# EAGLE design pwrfet (EAGLE 4.13)

## Sheet 1 of 2
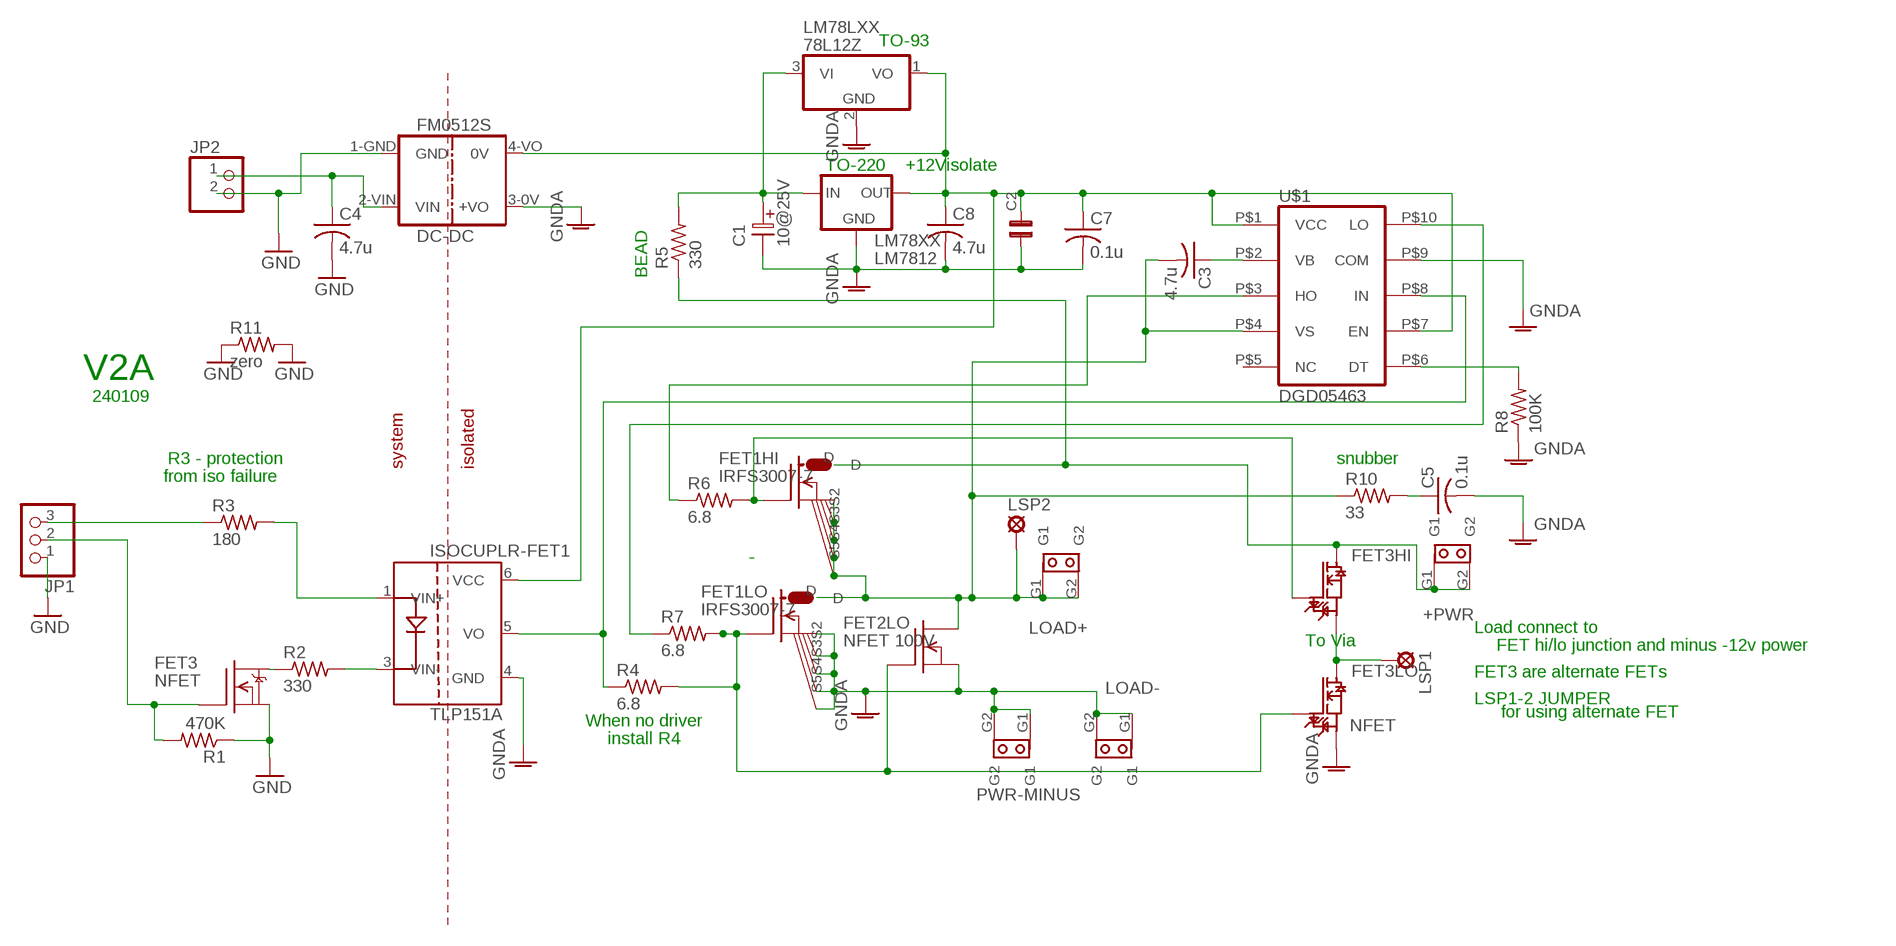
[diagram p0: schematic, sheet 1]

### Parts
+PWR  SPADE-TAB  [SPADE_TAB]
C1  10@25V  ELC-2,5L  [ES-2,5L]
C2  C1210  [1210]
C3  4.7u  C-USC0805  [C0805]
C4  4.7u  C-USC0805  [C0805]
C5  0.1u  C-USC0603  [C0603]
C7  0.1u  C-USC0603  [C0603]
C8  4.7u  C-USC0805  [C0805]
FET1HI  IRFS3007-7  [D2PAK-7]
FET1LO  IRFS3007-7  [D2PAK-7]
FET2LO  NFET 100V  RFP30N06  [TO220V]
FET3  NFET  DMN3404L  [SOT-23]
FET3HI  NFET-DT  [D-PAK-4]
FET3LO  NFET  NFET-DT  [D-PAK-4]
FM0512S  DC-DC  [DC-DC]
ISOCUPLR-FET1  TLP151A  [SOT23-5X]
JP1  PINHD-1X3  [1X03]
JP2  PINHD-1X2  [1X02]
LM78LXX  78L12Z  [TO92]
LM78XX  LM7812  78XXS  [78XXS]
LOAD+  SPADE-TAB  [SPADE_TAB]
LOAD-  SPADE-TAB  [SPADE_TAB]
LSP1  LoadB  LSP10  [LSP10]
LSP2  LoadB  LSP10  [LSP10]
PWR-MINUS  SPADE-TAB  [SPADE_TAB]
R1  470K  R-US_R0603  [R0603]
R2  330  R-US_R0603  [R0603]
R3  180  R-US_R0603  [R0603]
R4  6.8  R-US_R0603  [R0603]
R5  330  R-US_R0603  [R0603]
R6  6.8  R-US_R0603  [R0603]
R7  6.8  R-US_R0603  [R0603]
R8  100K  R-US_R0603  [R0603]
R10  33  R-US_R0603  [R0603]
R11  zero  R-US_R0603  [R0603]
U$1  DGD05463  [MSOP-10]

### Nets
+5VAUX: C4.1 FM0512S.2-VIN(VIN) JP2.1
+12VISO: C2.2 C7.1 C8.1 FM0512S.4-VO(0V) ISOCUPLR-FET1.6(VCC) LM78LXX.1(VO) LM78XX.OUT U$1.P$1(VCC) U$1.P$7(EN)
+PWR: +PWR.G1 +PWR.G2 FET1HI.D FET3HI.D R5.1
+PWR_RC: C1.1 LM78LXX.3(VI) LM78XX.IN R5.2
DRAINFET1: C3.2 FET1HI.S2(S1) FET1HI.S3(S2) FET1HI.S5(S3) FET1HI.S6(S4) FET1HI.S7(S5) FET1LO.D FET2LO.2(D) LOAD+.G1 LOAD+.G2 LSP2.MP R10.1 U$1.P$4(VS)
DT: R8.2 U$1.P$6(DT)
FET2GATE: FET1HI.G FET3HI.G R6.2
FET3-LOAD: FET3HI.S FET3LO.D LSP1.MP
GATE-FET1: FET1LO.G FET2LO.1(G) FET3LO.G R4.2 R7.2
GND: C4.2 FET3.2(S) FM0512S.1-GND(GND) JP1.1 JP2.2 R1.1 R11.1 R11.2
GNDA: C1.2 C2.1 C5.2 C7.2 C8.2 FET1LO.S2(S1) FET1LO.S3(S2) FET1LO.S5(S3) FET1LO.S6(S4) FET1LO.S7(S5) FET2LO.3(S) FET3LO.S FM0512S.3-0V(+VO) ISOCUPLR-FET1.4(GND) LM78LXX.2(GND) LM78XX.GND LOAD-.G1 LOAD-.G2 PWR-MINUS.G1 PWR-MINUS.G2 R8.1 U$1.P$9(COM)
HO: R6.1 U$1.P$3(HO)
IN: ISOCUPLR-FET1.5(VO) R4.1 U$1.P$8(IN)
ISO-ANODE: ISOCUPLR-FET1.1(VIN+) R3.2
ISO-CATH: ISOCUPLR-FET1.3(VIN-) R2.2
ISO-IN-DRAIN-FET1: FET3.3(D) R2.1
LO: R7.1 U$1.P$10(LO)
N$1: JP1.3 R3.1
ONOFF-FET1: FET3.1(G) JP1.2 R1.2
SNUB-RC: C5.1 R10.2
VB: C3.1 U$1.P$2(VB)
Unconnected: U$1.P$5(NC)

### Notes on the sheet
- TO-93
- TO-220 | +12Visolate
- BEAD
- V2A
- 240109
- R3 - protection | system | isolated | snubber
- from iso failure
- Load connect to
- To Via | FET hi/lo junction and minus -12v power
- FET3 are alternate FETs
- LSP1-2 JUMPER
- for using alternate FET
- When no driver
- install R4

## Sheet 2 of 2

## Library data of the parts
+PWR LOAD+ LOAD- PWR-MINUS = DEH:SPADE-TAB
C1 = DEH:ELC-2,5L
C2 = capsmd:C1210
C3-C5 C7 C8 = rcl:C-US: CAPACITOR, American symbol
FET1HI FET1LO = transistor-fet:IRFS3007-7
FET2LO = transistor-fet:RFP30N06
FET3 = transistor-fet:DMN3404L
FET3HI FET3LO = DEH:NFET-DT
FM0512S = DEH:DC-DC
ISOCUPLR-FET1 = texas:TLP151A
JP1 = pinhead:PINHD-1X3: PIN HEADER
JP2 = pinhead:PINHD-1X2: PIN HEADER
LM78LXX = linear:78*: Positive VOLTAGE REGULATOR
LM78XX = v-reg:78XXS: VOLTAGE REGULATOR
LSP1 LSP2 = solpad:LSP10: SOLDER PAD drill 1.0 mm, distributor Buerklin, 12H555
R1-R8 R10 R11 = rcl:R-US_: RESISTOR, American symbol
U$1 = 74xx-us:DGD05463

## Board
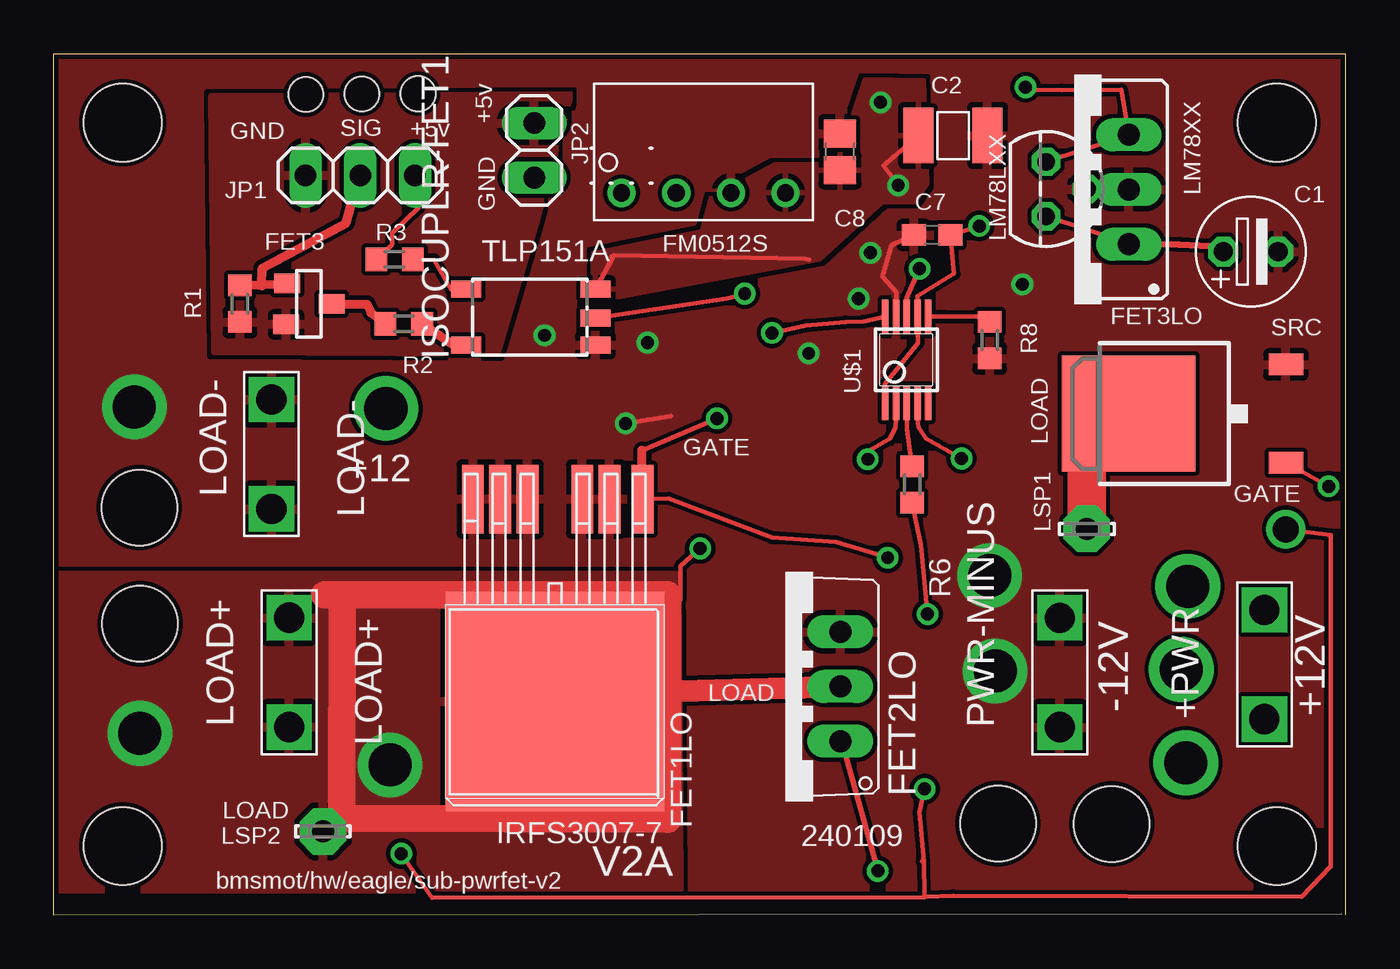
[diagram p1: board, top side]
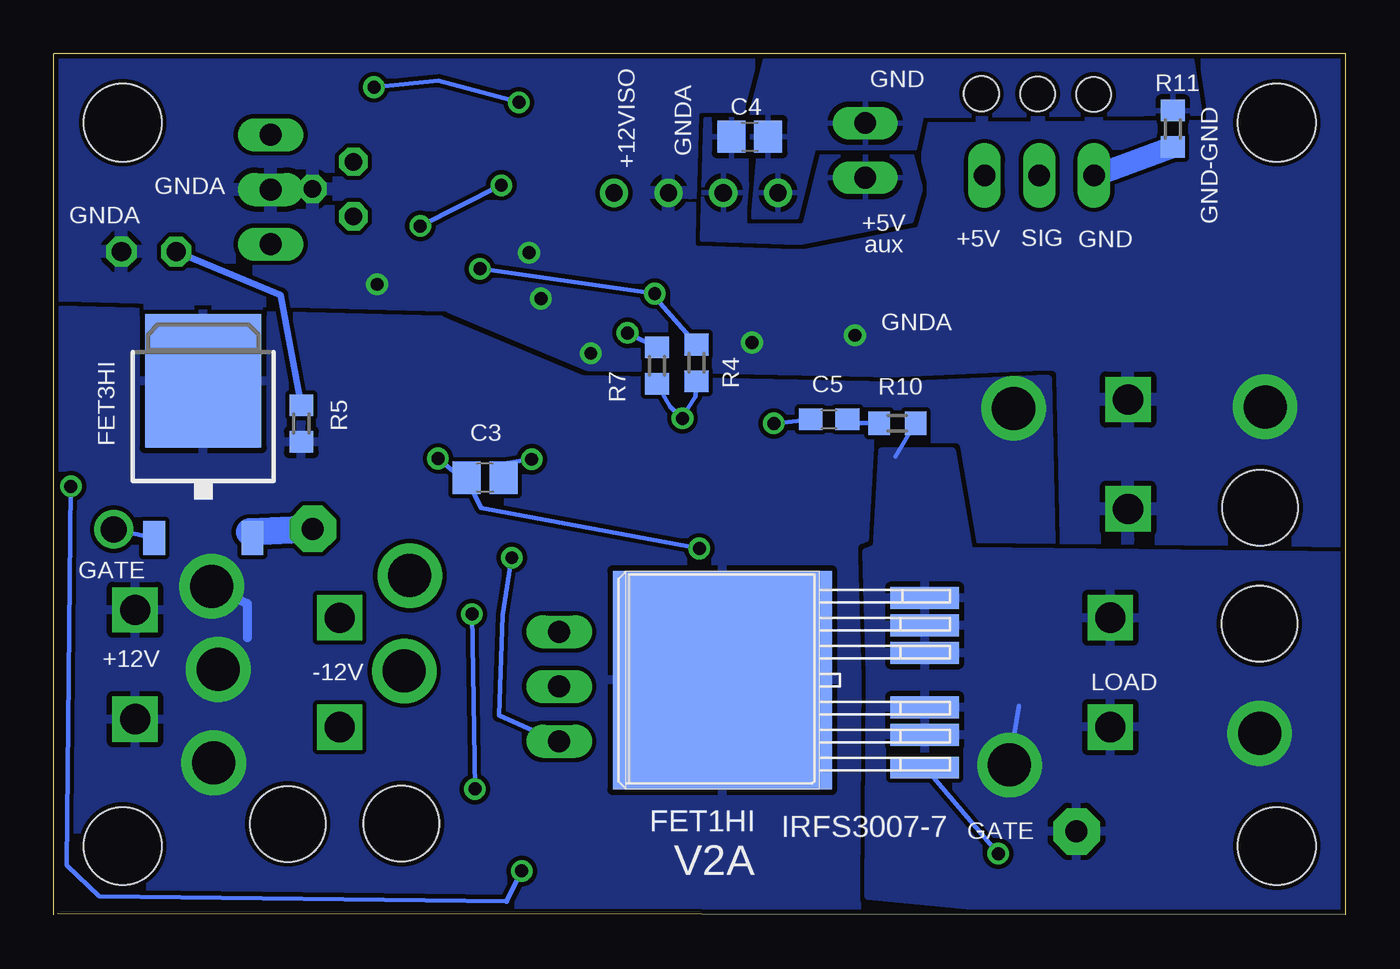
[diagram p2: board, bottom side, seen from below]

Size 60 x 40 mm. Coordinates in mm from the lower left corner, seen from the top.
Outline: 59.81,0.05 0,0 0,40 60,40 60,0
Copper layers (1*16): Top 0.035mm / dielectric 1.5mm / Bottom 0.035mm
Design rules "default": minimum track width 0.2mm, minimum drill 0.6mm, track to track 0.2mm, track to pad 0.2mm, pad to pad 0.2mm, via to via 8mil, smd to smd 0.2mm, copper to edge 9mil, drill to drill 8mil, minimum pad ring 10mil, minimum via ring 8mil, stop-mask expansion 4mil, vias tented up to drill 0mil, thermal gap 10mil
Holes 3.6 mm at 3.2,3.2 3.2,36.8 56.8,36.8 56.8,3.2
Holes 3.5 mm at 49.13,4.23 3.97,18.92 4.01,13.53 43.85,4.25
Holes 1.6 mm at 11.71,38.11 14.31,38.14 16.92,38.15

### Footprints (pad centres in the part's own frame; a part is rotated, then mirrored left to right if it is on the bottom)
SPADE_TAB = drill 1.4 square: G1 -2.54,0; G2 2.54,0
ES-2,5L = drill 0.889 pad 1.27 octagon: 1 0,0; 2 2.54,0
1210 = smd 1.397 x 2.591: 1 -1.6,0; 2 1.6,0
C0805 = smd 1.3 x 1.5: 1 -0.85,0; 2 0.85,0
C0603 = smd 1.1 x 1: 1 -0.85,0; 2 0.85,0
D2PAK-7 = smd 10.16 x 10.16: D 0,4.572 | smd 1.016 x 3.175: G -4.064,-4.826; S2 -2.54,-4.826; S3 -1.27,-4.826; S5 1.27,-4.826; S6 2.54,-4.826; S7 3.81,-4.826
TO220V = drill 1.016 long: 1 -2.54,-2.54; 2 0,-2.54; 3 2.54,-2.54
SOT-23 = smd 0.9 x 1.2: 1 -1,-1.006; 2 0.9,-1.056; 3 -0.05,1.056
D-PAK-4 = smd 5.4 x 6.2: D 0,-0.04 | smd 1 x 1.6: G -2.28,-7.34; S 2.28,-7.34
DC-DC = drill 0.8 round: 1-GND 0,-1.27; 2-VIN 2.54,-1.27; 3-0V 5.08,-1.27; 4-VO 7.62,-1.27
SOT23-5X = smd 0.8 x 1.4: 1 1.35,2.97; 3 -1.25,2.97; 4 -1.25,-3.03; 5 0,-3.03; 6 1.35,-3.03
1X03 = drill 1 long: 1 -2.54,0; 2 0,0; 3 2.54,0
1X02 = drill 1 long: 1 -1.27,0; 2 1.27,0
TO92 = drill 0.813 octagon: 1 -1.27,0; 2 0,1.905; 3 1.27,0
78XXS = drill 1.016 long: GND 0,-2.54; IN -2.54,-2.54; OUT 2.54,-2.54
LSP10 = drill 1.016 pad 2.159 octagon: MP 0,0
R0603 = smd 1 x 1.1: 1 -0.85,0; 2 0.85,0
MSOP-10 = smd 0.3 x 1.6: P$1 -1,-2; P$2 -0.5,-2; P$3 0,-2; P$4 0.5,-2; P$5 1,-2; P$6 1,2; P$7 0.5,2; P$8 0,2; P$9 -0.5,2; P$10 -1,2

### Placement (x,y rotation side)
+PWR  56.23,11.63 90 top
C1  54.32,30.81 0 top
C2  41.77,36.21 180 top
C3  39.97,20.31 180 bottom
C4  27.68,36.15 0 bottom
C5  23.99,23.02 180 bottom
C7  40.8,31.58 180 top
C8  36.51,35.45 90 top
FET1HI  24.38,10.91 90 bottom
FET1LO  23.27,14.49 180 top
FET2LO  33.99,10.61 90 top
FET3  11.84,28.33 270 top
FET3HI  53.06,24.85 0 bottom
FET3LO  49.88,23.29 90 top
FM0512S  26.36,34.81 0 top
ISOCUPLR-FET1  22.12,27.72 90 top
JP1  14.23,34.35 0 top
JP2  22.31,35.52 90 top
LM78LXX  46.08,33.72 270 top
LM78XX  47.39,33.7 90 top
LOAD+  10.93,11.26 270 top
LOAD-  10.11,21.4 270 top
LSP1  47.98,17.93 0 top
LSP2  12.5,3.88 0 top
PWR-MINUS  46.73,11.26 90 top
R1  8.64,28.39 90 top
R2  16.25,27.46 0 top
R3  15.82,30.45 0 top
R4  30.15,25.64 270 bottom
R5  48.5,22.82 90 bottom
R6  39.86,20 270 top
R7  31.99,25.52 270 bottom
R8  43.47,26.7 90 top
R10  20.82,22.84 180 bottom
R11  8.03,36.52 270 bottom
U$1  39.61,25.79 0 top

### Tracks (layer width: path | path; a pad name or v marks a point on that pad's centre or on a via)
+5VAUX
  pour Bottom (rank 3): 29.9,31.36 29.73,36.96 27.87,36.95 27.78,32.33 26.45,32.04 25.35,32.23 24.45,35.7 20.23,35.63 19.74,33.74 20.16,32.24 25.4,31.21
+12VISO  (via drill 0.6)
  Top 0.202: U$1.P$1 38.61,24.65 40.14,26.57 40.12,27.02 40.1,27.77 U$1.P$7 40.12,27.82 40.12,28.75 41.81,29.79 C7.1 v42.98,32.01 | LM78XX.OUT LM78LXX.1 | C2.2 38.53,34.79 v39.22,33.9
  Top 0.203: v45.13,38.45 45.5,38.33 46.81,38.32 49.58,38.32 LM78XX.OUT | ISOCUPLR-FET1.6 26.03,30.66 | 26.03,30.66 34.86,30.49 35.07,30.44 | 26.03,30.66 25.9,30.59
  Top 0.254: ISOCUPLR-FET1.6 25.18,29.11
  Bottom 0.202: v45.13,38.45 42.13,38.75 v38.4,37.74 | v42.98,32.01 v39.22,33.9
  pour Top: 31.61,33.86 30.66,33.86 30.1,31.77 25.04,30.75 25.04,29.15 26.13,28.67 35.55,30.44 38.48,33.1 39.99,33.11 40.57,33.94 40.41,38.77 37.68,38.81 36.34,34.88 33.52,34.86
+PWR  (via drill 2)
  Bottom 0.406: v52.67,15.26 51.01,14.45 51.01,12.87
  other vias: 52.58,7.06 52.37,11.4 15.42,23.53
  pour Bottom (rank 3): -1.34,-1.99 -0.03,17.59 13.66,17.3 13.84,24.89 21.02,24.57 35.47,24.87 42.06,27.64 62.46,28.16 62.14,-2.04
+PWR_RC
  Top 0.202: LM78XX.IN 50.02,31.17 LM78LXX.3
  Top 0.305: LM78XX.IN 52.25,31.15 53.68,31.06 C1.1
  Bottom 0.305: R5.2 49.46,28.79 C1.1
DRAINFET1  (via drill 0.6, 2)
  Top 0.202: v30.02,17.02 29.11,16.21 29.1,14.66 28.5,14.85 | v42.16,21.2 40.5,22.14 40.16,22.68 40.11,23.05 40.12,23.76 U$1.P$4
  Top 1.016: 28.5,10.39 28.27,10.39 FET2LO.2
  Top 1.27: 12.58,14.87 28.5,14.87 28.5,14.85 28.5,10.39 28.51,4.45 13.37,4.48 13.39,14.78
  Bottom 0.202: v30.02,17.02 40.15,18.9 C3.2 41.29,20.48 v42.16,21.2 | R10.1 20.92,21.3
  Bottom 0.203: v15.61,6.97 15.18,9.71
  other vias: 4,8.43
  pour Top (rank 2): 28.95,15.79 29.05,1.19 -1.51,1.16 -1.7,15.79 4.24,15.79
  pour Bottom (rank 2): 22.09,11.14 22.16,0.91 -3.55,-1.57 -3.31,4.74 -0.2,16.66 17.49,16.89 18.3,21.5 21.52,21.52 21.77,17.04 22.25,16.84
DT
  Top 0.202: U$1.P$6 41.34,27.8 42.91,27.79 43.48,27.52 R8.2
FET2GATE  (via drill 0.6, 1.2)
  Top 0.202: v16.14,2.85 17.58,0.8 40.44,0.81 40.44,0.85 40.4,2.49 40.2,4.77
  Top 0.203: R6.2 40.27,17.19 v40.58,13.98 | 40.2,4.77 40.4,5.75 v40.44,5.85 | v57.22,17.91 59.3,17.66 59.31,2.26 57.95,0.85 41.77,0.89 40.45,0.85 40.44,0.85 | 40.4,2.49 40.32,2.48
  Bottom 0.202: v16.14,2.85 FET1HI.G
  Bottom 0.203: v40.44,5.85 v40.58,13.98 | v57.22,17.91 FET3HI.G
FET3-LOAD
  Top 1.778: LSP1.MP 47.99,21.5 49.82,23.34 FET3LO.D
  Bottom 0.61: FET3HI.S 50.91,17.78
  Bottom 1.27: 50.91,17.78 LSP1.MP
GATE-FET1  (via drill 0.6)
  Top 0.203: 27.32,21.57 v30.8,23.06 | FET1LO.G 28.56,19.35 33.35,17.53 36.33,17.33 v38.73,16.59 | v59.21,19.91 FET3LO.G
  Top 0.254: FET2LO.1 36.62,7.95 v38.27,2.04
  Top 0.406: FET1LO.G 27.32,21.57
  Bottom 0.202: v30.8,23.06 31.38,23.61 R7.2
  Bottom 0.203: v38.73,16.59 39.17,13.91 39.33,9.26 36.67,8.08 FET2LO.1 36.74,7.94 | v59.21,19.91 59.41,2.3 57.89,0.86 38.97,0.62 | R4.2 30.2,24.09 30.86,23.07 v30.8,23.06
  Bottom 0.254: 36.74,7.94 36.7,7.74 36.6,7.98 | v38.27,2.04 38.97,0.62
GND
  Bottom 1.016: JP1.1 11.66,34.31 R11.2
  pour Top (rank 2): 23.93,38.09 22.32,32.15 20.54,26.12 20.1,26.12 7.51,26.18 7.37,37.99
  pour Bottom (rank 2): 20.04,35.62 24.72,35.63 25.51,32.44 27.51,32.42 27.21,35.79 27.96,35.82 26.94,39.7 7.14,39.67 6.76,37.24 19.71,37.13
GNDA  (via drill 0.6, 2)
  Top 0.202: U$1.P$9 39.13,28.92 38.48,29.65 38.9,31.11 C7.2 | v26.56,22.83 28.67,23.18
  Bottom 0.202: C5.2 v26.56,22.83
  other vias: 43.47,15.76 3.74,23.6 43.73,11.33 37.93,30.76 37.38,28.63 27.57,26.59 22.79,26.92 35.06,26.09 44.98,29.29
  pour Top (rank 3): -1.97,41.09 19.27,41.02 61.99,40.99 62.24,-2 -1.37,-2.17 -1.44,16.74
  pour Bottom (rank 5): -1.94,16.37 13.51,16.45 13.56,25.66 21.11,23.51 42.69,24.36 64.46,28.29 64.36,41.41 -3.7,41.54
HO
  Top 0.202: U$1.P$3 39.62,23 39.62,22.57 39.82,21.19 39.81,21.1 R6.1
IN  (via drill 0.6)
  Top 0.202: U$1.P$8 39.61,28.62 v40.21,30.02 | 31.97,28.82 32.02,28.79 v32.09,28.86
  Top 0.203: ISOCUPLR-FET1.5 31.23,28.62 31.97,28.82
  Bottom 0.202: v32.09,28.86 v40.21,30.02
  Bottom 0.203: v32.09,28.86 32.16,28.78 R4.1
ISO-ANODE
  Top 0.203: ISOCUPLR-FET1.1 18.46,29.04 17.67,30.42 R3.2
ISO-CATH
  Top 0.406: ISOCUPLR-FET1.3 18.45,26.54 R2.2
ISO-IN-DRAIN-FET1
  Top 0.406: FET3.3 14.54,28.37 14.73,27.97 R2.1
LO  (via drill 0.6)
  Top 0.202: U$1.P$10 37.6,27.57 36.77,27.55 34.92,27.38 v33.35,27.04
  Bottom 0.202: R7.1 v33.35,27.04
N$1
  Top 0.203: R3.1 15.71,31.13 15.71,31.67 16.94,32.85 16.98,33.97 JP1.3
ONOFF-FET1
  Top 0.406: FET3.1 10.88,29.33 9.66,29.29 | R1.2 9.66,29.29 | 9.66,29.29 9.66,29.22 9.68,30.04 13.57,32.13 14.15,34.22 JP1.2
SNUB-RC
  Bottom 0.202: C5.1 22.53,22.86 R10.2
VB  (via drill 0.6)
  Top 0.202: v37.8,21.17 37.93,21.59 38.84,22.12 39.08,22.64 39.11,22.98 39.12,23.76 U$1.P$2
  Bottom 0.202: C3.1 39.07,20.97 v37.8,21.17

### Text on the board
tPlace: GND | +5v | +5v | SIG | GND
bPlace: GNDA
tNames: TLP151A | SRC | LOAD | GATE | +12 | LOAD- | GATE | -12V | +12V | LOAD | LOAD+ | LOAD | IRFS3007-7 | 240109 | V2A | bmsmot/hw/eagle/sub-pwrfet-v2
bNames: GNDA | +12VISO | GND-GND | GND | +5V | GNDA | GND | SIG | +5V | aux | GNDA | GATE | +12V | -12V | LOAD | GATE | IRFS3007-7 | V2A